# Altium schematic sheet Схема электрическая Интерфейс.SchDoc
size 209 x 297 mm
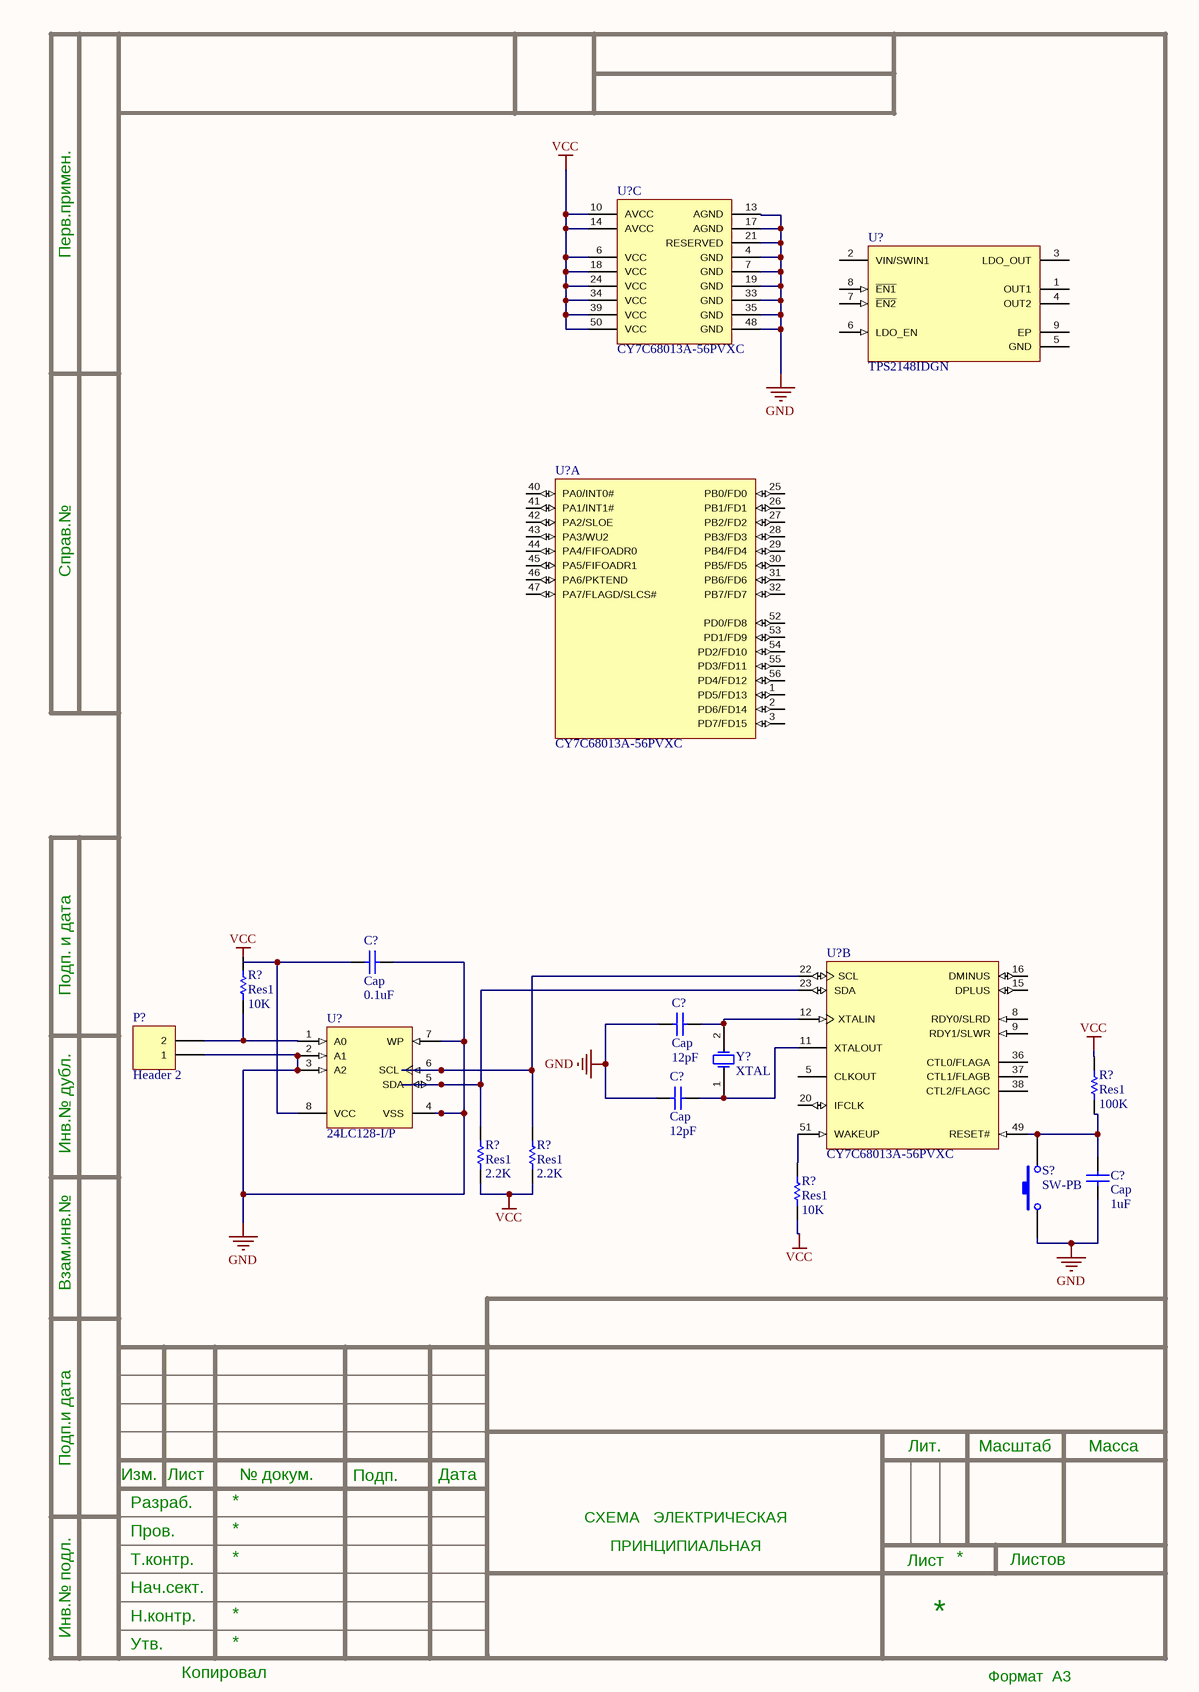
[diagram p0: Схема электрическая Интерфейс.SchDoc]

## Parts
(Parts that share a designator on the sheet are numbered #1, #2 ... from top to bottom, then left to right.)
C?#1  Cap  value 0.1uF  [RAD-0.3]
C?#2  Cap  value 12pF  [RAD-0.3]
C?#3  Cap  value 12pF  [RAD-0.3]
C?#4  Cap  value 1uF  [RAD-0.3]
P?  Header 2  [HDR1X2]
R?#1  Res1  value 10K  [AXIAL-0.3]
R?#2  Res1  value 100K  [AXIAL-0.3]
R?#3  Res1  value 2.2K  [AXIAL-0.3]
R?#4  Res1  value 2.2K  [AXIAL-0.3]
R?#5  Res1  value 10K  [AXIAL-0.3]
S?  SW-PB  [SPST-2]
U?#1  CY7C68013A-56PVXC  [CYP-PVX56_N]  (part C of 3)
U?#2  TPS2148IDGN  [DGN8-1760X1425TP_N]
U?#3  CY7C68013A-56PVXC  [CYP-PVX56_N]  (part A of 3)
U?#4  CY7C68013A-56PVXC  [CYP-PVX56_N]  (part B of 3)
U?#5  24LC128-I/P  [PDIP300-P8]
Y?  XTAL  [R38]

## Nets
GND: C?#1.2 C?#2.1 C?#3.1 C?#4.1 P?.1 S?.1 U?#1.4(GND) U?#1.7(GND) U?#1.13(AGND) U?#1.17(AGND) U?#1.19(GND) U?#1.21(RESERVED) U?#1.33(GND) U?#1.35(GND) U?#1.48(GND) U?#5.2(A1) U?#5.3(A2) U?#5.4(VSS) U?#5.7(WP)
VCC: C?#1.1 R?#2.1 R?#3.2 R?#4.2 R?#5.2 U?#1.6(VCC) U?#1.10(AVCC) U?#1.14(AVCC) U?#1.18(VCC) U?#1.24(VCC) U?#1.34(VCC) U?#1.39(VCC) U?#1.50(VCC) U?#5.8(VCC)
NetC?#2_2: C?#2.2 U?#4.12(XTALIN) Y?.2(OSC2)
NetC?#3_2: C?#3.2 U?#4.11(XTALOUT) Y?.1(OSC1)
NetC?#4_2: C?#4.2 R?#2.2 S?.2 U?#4.49(RESET#)
NetP?_2: P?.2 R?#1.1 U?#5.1(A0)
NetR?#3_1: R?#3.1 U?#4.23(SDA) U?#5.5(SDA)
NetR?#4_1: R?#4.1 U?#4.22(SCL) U?#5.6(SCL)
NetR?#5_1: R?#5.1 U?#4.51(WAKEUP)

Not connected (* = marked no-connect by the designer): R?#1 2; U?#2 1(OUT1) 2(VIN/SWIN1) 3(LDO_OUT) 4(OUT2) 5(GND) 6(LDO_EN) 7(~{EN2}) 8(~{EN1}) 9(EP); U?#3 1(PD5/FD13) 2(PD6/FD14) 3(PD7/FD15) 25(PB0/FD0) 26(PB1/FD1) 27(PB2/FD2) 28(PB3/FD3) 29(PB4/FD4) 30(PB5/FD5) 31(PB6/FD6) 32(PB7/FD7) 40(PA0/INT0#) 41(PA1/INT1#) 42(PA2/SLOE) 43(PA3/WU2) 44(PA4/FIFOADR0) 45(PA5/FIFOADR1) 46(PA6/PKTEND) 47(PA7/FLAGD/SLCS#) 52(PD0/FD8) 53(PD1/FD9) 54(PD2/FD10) 55(PD3/FD11) 56(PD4/FD12); U?#4 5(CLKOUT) 8(RDY0/SLRD) 9(RDY1/SLWR) 15(DPLUS) 16(DMINUS) 20(IFCLK) 36(CTL0/FLAGA) 37(CTL1/FLAGB) 38(CTL2/FLAGC)

## Notes on the sheet
- Перв.примен.
- Справ.№
- Подп. и дата
- Инв.№ дубл.
- Взам.инв.№
- Подп.и дата
- Разраб.
- Изм.
- Лист
- № докум.
- Подп.
- Дата
- Лит.
- Масштаб
- Масса
- Т.контр.
- Пров.
- СХЕМА   ЭЛЕКТРИЧЕСКАЯ
- ПРИНЦИПИАЛЬНАЯ
- Листов
- Инв.№ подл.
- Утв.
- Н.контр.
- Нач.сект.
- Копировал
- Формат  A3

## Library data of the parts
C?#1-C?#4 = Cap: Capacitor; Published: 8-Jun-2000; LatestRevisionDate: 17-Jul-2002; LatestRevisionNote: Re-released for DXP Platform.; PackageReference: RAD-0.3; Publisher: Altium Limited; PackageDescription: Radial Cap, Thru-Hole; 2 Leads; 0.3 in Pin Spacing
P? = Header 2: Header, 2-Pin; LatestRevisionDate: 17-Jul-2002; LatestRevisionNote: Re-released for DXP Platform.; Publisher: Altium Limited
R?#1-R?#5 = Res1: Resistor; Published: 8-Jun-2000; LatestRevisionDate: 17-Jul-2002; LatestRevisionNote: Re-released for DXP Platform.; PackageReference: AXIAL-0.3; Publisher: Altium Limited; PackageDescription: Axial Device, Thru-Hole; 2 Leads; 0.3 in Pin Spacing
S? = SW-PB: Switch; Published: 24-Mar-1999; LatestRevisionDate: 17-Jul-2002; LatestRevisionNote: Re-released for DXP Platform.; PackageReference: SPST-2; Publisher: Altium Limited; PackageDescription: Switch; 2 Leads
U?#1 U?#3 U?#4 = CY7C68013A-56PVXC: EZ-USB(R) FX2LP(TM) USB Microcontroller High-Speed USB Peripheral Controller, 16 KB, 24 I/Os, 3 to 3.6 V, 0 to 70 degC, 56-Pin SSOP (PVX56), Tube; Manufacturer: Cypress; Max. Operating Voltage (V): 3.6; Memory Architecture: RAM; Memory Size (KB): 16; Min. Operating Voltage (V): 3; No. of I/Os: 24; DatasheetVersion: Rev. *W; PackageVersion: Rev. *F, 08/2012; PackageReference: PVX56; PackageDescription: 56-Pin Shrunk Small Outline Package, Body 7.506 x 18.415 mm, Pitch 0.635 mm; Supplier 1: Digi-Key; Supplier Part Number 1: 428-1627-ND; Supplier 2: Farnell; Supplier Part Number 2: 1269134; Supplier 3: Newark; Supplier Part Number 3: 19M7114; Supplier 4: Mouser; Supplier Part Number 4: 727-CY768013A-56PVXC; CPU Core: Enhanced 8051; Max. Operating Temp. (degreesC): 70; Min. Operating Temp. (degreesC): 0; Packing: Tube; RoHS: Pb-Free; Mounting Technology: Surface Mount; PartNumber: CY7C68013A-56PVXC; ComponentLink1Description: Manufacturer URL; ComponentLink1URL: http://www.cypress.com/; ComponentLink2Description: Datasheet; ComponentLink2URL: http://www.cypress.com/?docID=45142; ComponentLink3Description: Package Specification; ComponentLink3URL: http://www.cypress.com/?docID=39259
U?#2 = TPS2148IDGN: 3.3 V LDO + Dual Switch for USB Peripherals, Active-Low Enables, 2 Ports, 2 FETs, 200 mA LDO Output Current, -40 to 85 degC, 8-pin MSOP-PowerPAD (DGN), Green (RoHS & no Sb/Br); Manufacturer: Texas Instruments; LDO Output Current(mA): 200; LDO Output Range(V): 3.3; Number of FETs: 2; rDS(on) per FET, Bus Power(Typ)(mOhms): 340; SubFamily: USB Power Controller; Switch Current Limit, Bus Power(Min)(A): 0.2; Switch Enable: L; Vin(Max)(V): 5.5; Vin(Min)(V): 2.9; DatasheetVersion: SLVS373; PackageVersion: revF, May-2011; PackageReference: DGN8-1760X1425TP; PackageDescription: 8-Pin PowerPAD Plastic Small Outline Package 3 x 3 mm Body ,0.65 mm Pitch, Exposed Pad; Supplier 1: Digi-Key; Supplier Part Number 1: 296-13387-5-ND; Supplier 2: Newark; Supplier Part Number 2: 77C0096; Supplier 3: Mouser; Supplier Part Number 3: 595-TPS2148IDGN; Application: USB peripheral; Ports(Max): 2; Mounting Technology: Surface Mount; Code_JEDEC: MO-187-AA-T; PartNumber: TPS2148IDGN; ComponentLink1Description: Datasheet; ComponentLink1URL: http://www.ti.com/general/docs/lit/getliterature.tsp?genericPartNumber=TPS2148&fileType=pdf
U?#5 = 24LC128-I/P: 128Kbit, 400kHz, 2.5V, I2C Serial EEPROM, 8-Pin PDIP, Industrial Temperature; Manufacturer: Microchip; DatasheetVersion: revR, Apr-2009; PackageVersion: revBB, Aug-2009; PackageReference: PDIP300-P8; PackageDescription: 8-Lead Plastic Dual In-Line (P) - 300 mil Body [PDIP]; Supplier 1: Digi-Key; Supplier Part Number 1: 24LC128-I/P-ND; Supplier 2: Farnell; Supplier Part Number 2: 9757929; Supplier 3: Newark; Supplier Part Number 3: 12C2007; Supplier 4: Mouser; Supplier Part Number 4: 579-24LC128-I/P; Mounting Technology: Through Hole; Code_JEDEC: MS-001; PartNumber: 24LC128-I/P; ComponentLink1Description: Manufacturer URL; ComponentLink1URL: http://www.microchip.com/; ComponentLink2Description: Datasheet; ComponentLink2URL: http://ww1.microchip.com/downloads/en/DeviceDoc/21191R.pdf; ComponentLink3Description: Package Specification; ComponentLink3URL: http://www.microchip.com/stellent/groups/techpub_sg/documents/packagingspec/en012702.pdf
Y? = XTAL: Crystal Oscillator; Published: 8-Jun-2000; LatestRevisionDate: 17-Jul-2002; LatestRevisionNote: Re-released for DXP Platform.; PackageReference: R38; Publisher: Altium Limited; PackageDescription: Crystal, Thru-Hole; 2 Leads; Body 3.1 x 8.2 mm (Dia.xH)